# Altium schematic sheet HVP_InputDivisor_v1.0.SchDoc
size A3; Organization: SEW EURODRIVE; Address1: Jose Rubim Rd.; Address2: Santos Dumont Rd.; Address3: 205; Address4: Indaiatuba/SP; Address5: Brazil
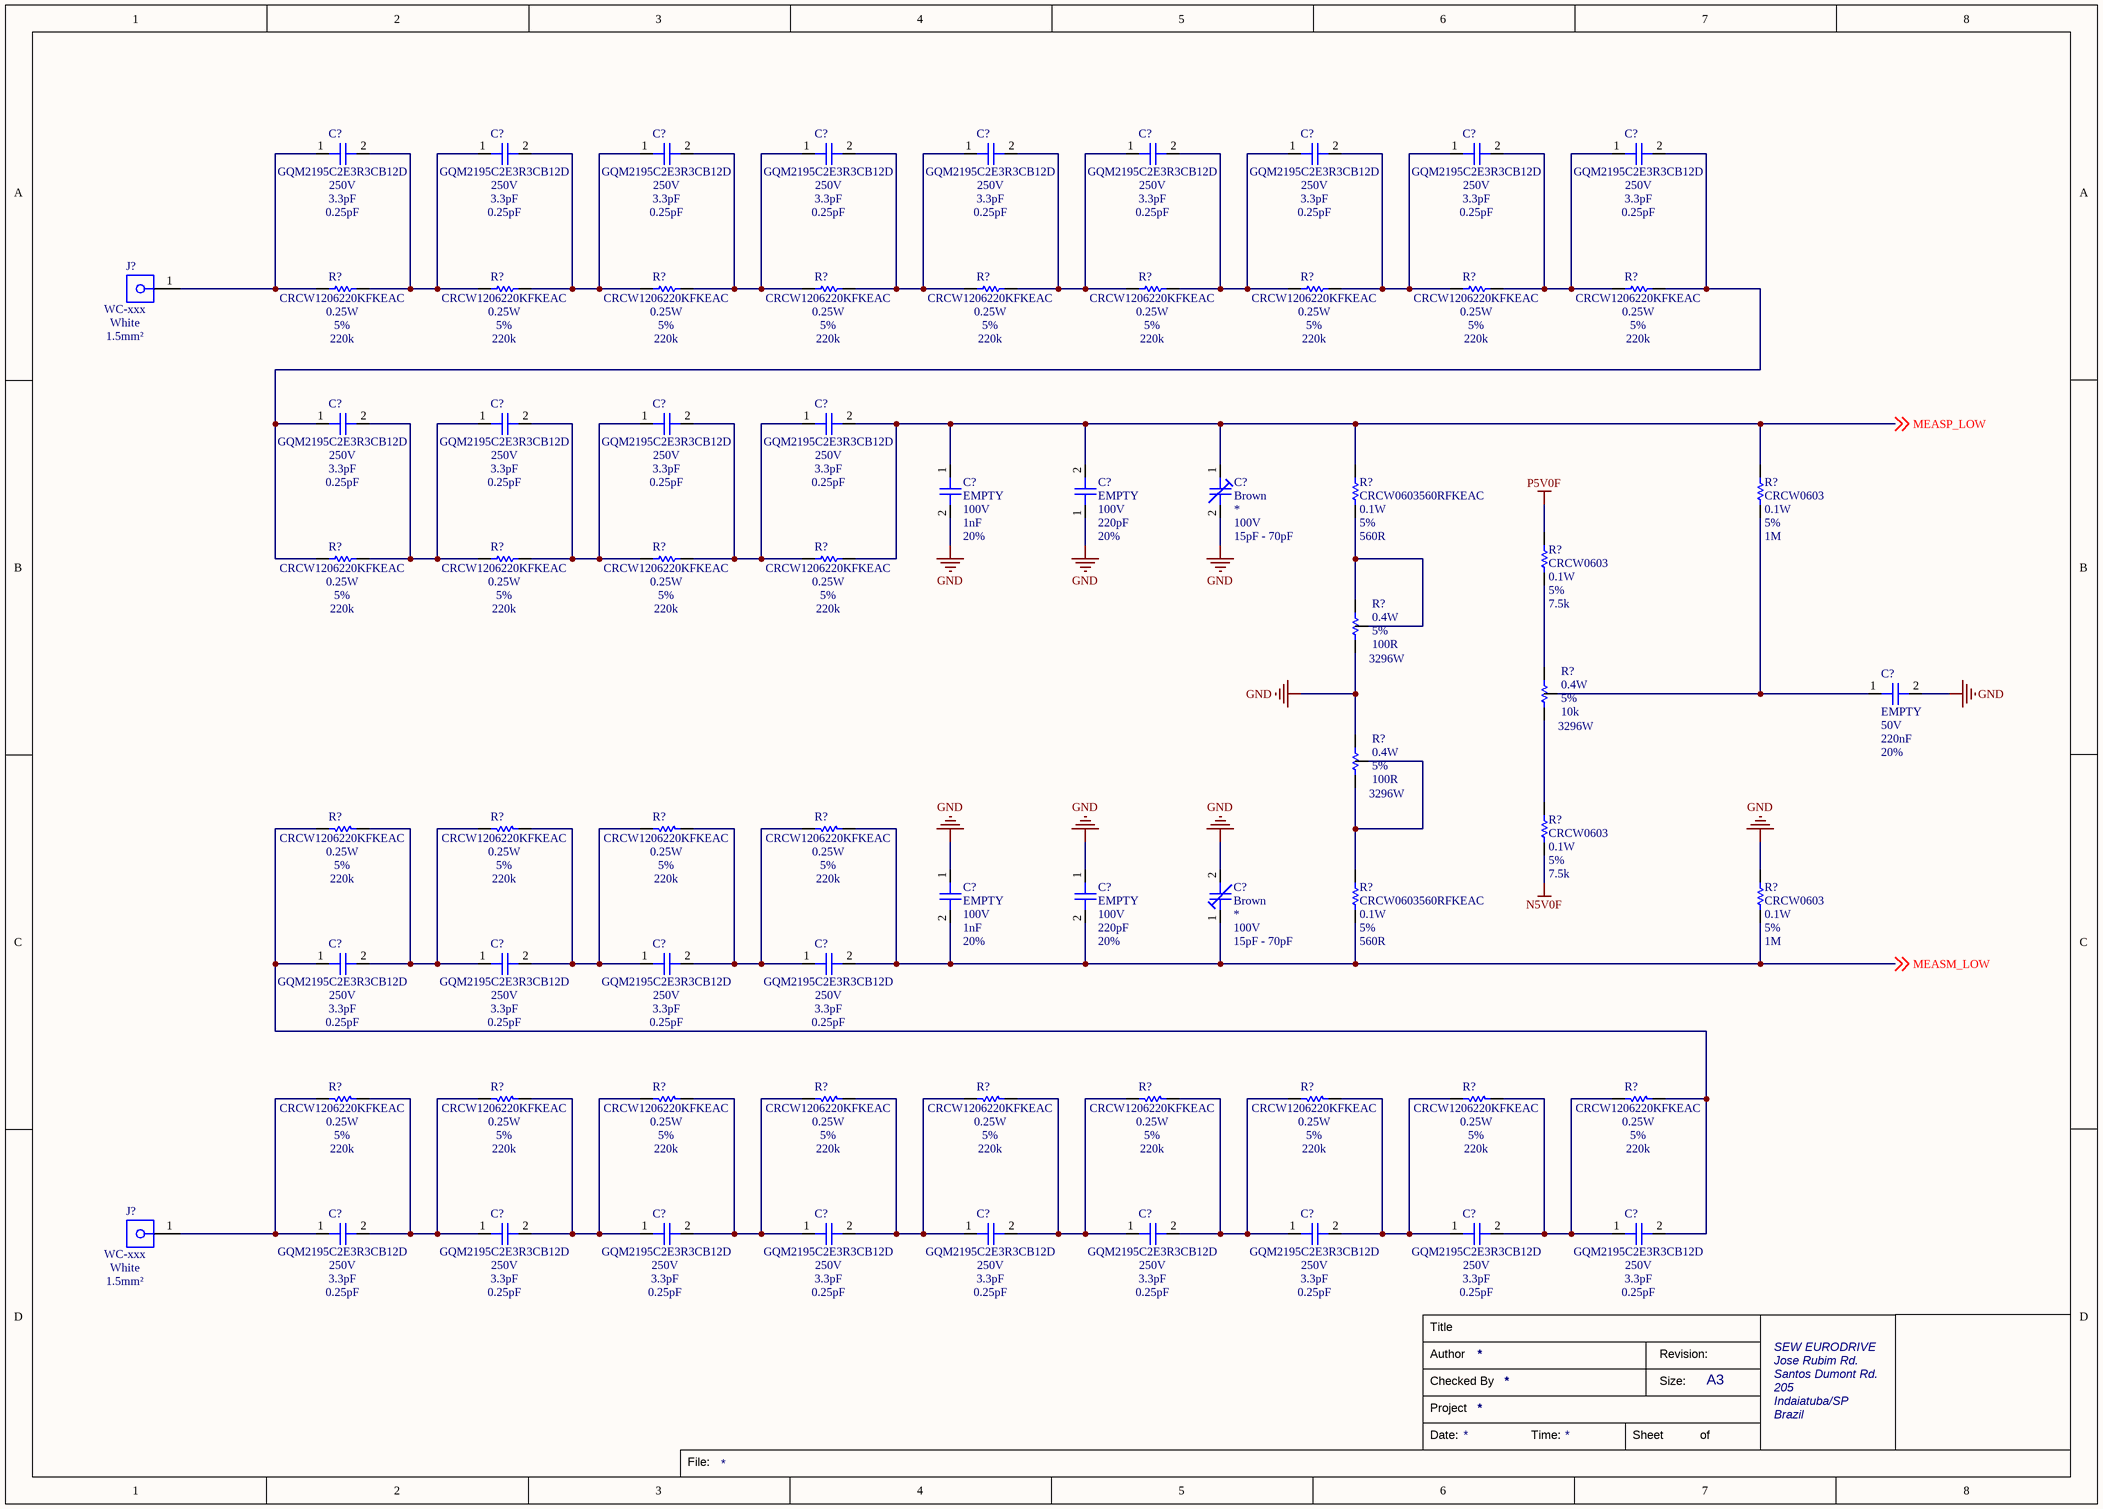
[diagram p0: HVP_InputDivisor_v1.0.SchDoc]

## Parts
(Parts that share a designator on the sheet are numbered #1, #2 ... from top to bottom, then left to right.)
C?#1  value 3.3pF  PartNumber1: GQM2195C2E3R3CB12D  Voltage: 250V  Tolerance: 0.25pF  [CAP0805]  (hidden comment: CC0805)
C?#2  value 3.3pF  PartNumber1: GQM2195C2E3R3CB12D  Voltage: 250V  Tolerance: 0.25pF  [CAP0805]  (hidden comment: CC0805)
C?#3  value 3.3pF  PartNumber1: GQM2195C2E3R3CB12D  Voltage: 250V  Tolerance: 0.25pF  [CAP0805]  (hidden comment: CC0805)
C?#4  value 3.3pF  PartNumber1: GQM2195C2E3R3CB12D  Voltage: 250V  Tolerance: 0.25pF  [CAP0805]  (hidden comment: CC0805)
C?#5  value 3.3pF  PartNumber1: GQM2195C2E3R3CB12D  Voltage: 250V  Tolerance: 0.25pF  [CAP0805]  (hidden comment: CC0805)
C?#6  value 3.3pF  PartNumber1: GQM2195C2E3R3CB12D  Voltage: 250V  Tolerance: 0.25pF  [CAP0805]  (hidden comment: CC0805)
C?#7  value 3.3pF  PartNumber1: GQM2195C2E3R3CB12D  Voltage: 250V  Tolerance: 0.25pF  [CAP0805]  (hidden comment: CC0805)
C?#8  value 3.3pF  PartNumber1: GQM2195C2E3R3CB12D  Voltage: 250V  Tolerance: 0.25pF  [CAP0805]  (hidden comment: CC0805)
C?#9  value 3.3pF  PartNumber1: GQM2195C2E3R3CB12D  Voltage: 250V  Tolerance: 0.25pF  [CAP0805]  (hidden comment: CC0805)
C?#10  value 3.3pF  PartNumber1: GQM2195C2E3R3CB12D  Voltage: 250V  Tolerance: 0.25pF  [CAP0805]  (hidden comment: CC0805)
C?#11  value 3.3pF  PartNumber1: GQM2195C2E3R3CB12D  Voltage: 250V  Tolerance: 0.25pF  [CAP0805]  (hidden comment: CC0805)
C?#12  value 3.3pF  PartNumber1: GQM2195C2E3R3CB12D  Voltage: 250V  Tolerance: 0.25pF  [CAP0805]  (hidden comment: CC0805)
C?#13  value 3.3pF  PartNumber1: GQM2195C2E3R3CB12D  Voltage: 250V  Tolerance: 0.25pF  [CAP0805]  (hidden comment: CC0805)
C?#14  value 1nF  PartNumber1: EMPTY  Voltage: 100V  Tolerance: 20%  [CAP0603]  (hidden comment: CC0603)
C?#15  value 220pF  PartNumber1: EMPTY  Voltage: 100V  Tolerance: 20%  [CAP0603]  (hidden comment: CC0603)
C?#16  value 15pF - 70pF  Colour: Brown  Voltage: 100V  [TrimmerBrown]  (hidden comment: TrimmerBrown_70pF_100V)
C?#17  value 220nF  PartNumber1: EMPTY  Voltage: 50V  Tolerance: 20%  [CAP0603]  (hidden comment: CC0603)
C?#18  value 1nF  PartNumber1: EMPTY  Voltage: 100V  Tolerance: 20%  [CAP0603]  (hidden comment: CC0603)
C?#19  value 220pF  PartNumber1: EMPTY  Voltage: 100V  Tolerance: 20%  [CAP0603]  (hidden comment: CC0603)
C?#20  value 15pF - 70pF  Colour: Brown  Voltage: 100V  [TrimmerBrown]  (hidden comment: TrimmerBrown_70pF_100V)
C?#21  value 3.3pF  PartNumber1: GQM2195C2E3R3CB12D  Voltage: 250V  Tolerance: 0.25pF  [CAP0805]  (hidden comment: CC0805)
C?#22  value 3.3pF  PartNumber1: GQM2195C2E3R3CB12D  Voltage: 250V  Tolerance: 0.25pF  [CAP0805]  (hidden comment: CC0805)
C?#23  value 3.3pF  PartNumber1: GQM2195C2E3R3CB12D  Voltage: 250V  Tolerance: 0.25pF  [CAP0805]  (hidden comment: CC0805)
C?#24  value 3.3pF  PartNumber1: GQM2195C2E3R3CB12D  Voltage: 250V  Tolerance: 0.25pF  [CAP0805]  (hidden comment: CC0805)
C?#25  value 3.3pF  PartNumber1: GQM2195C2E3R3CB12D  Voltage: 250V  Tolerance: 0.25pF  [CAP0805]  (hidden comment: CC0805)
C?#26  value 3.3pF  PartNumber1: GQM2195C2E3R3CB12D  Voltage: 250V  Tolerance: 0.25pF  [CAP0805]  (hidden comment: CC0805)
C?#27  value 3.3pF  PartNumber1: GQM2195C2E3R3CB12D  Voltage: 250V  Tolerance: 0.25pF  [CAP0805]  (hidden comment: CC0805)
C?#28  value 3.3pF  PartNumber1: GQM2195C2E3R3CB12D  Voltage: 250V  Tolerance: 0.25pF  [CAP0805]  (hidden comment: CC0805)
C?#29  value 3.3pF  PartNumber1: GQM2195C2E3R3CB12D  Voltage: 250V  Tolerance: 0.25pF  [CAP0805]  (hidden comment: CC0805)
C?#30  value 3.3pF  PartNumber1: GQM2195C2E3R3CB12D  Voltage: 250V  Tolerance: 0.25pF  [CAP0805]  (hidden comment: CC0805)
C?#31  value 3.3pF  PartNumber1: GQM2195C2E3R3CB12D  Voltage: 250V  Tolerance: 0.25pF  [CAP0805]  (hidden comment: CC0805)
C?#32  value 3.3pF  PartNumber1: GQM2195C2E3R3CB12D  Voltage: 250V  Tolerance: 0.25pF  [CAP0805]  (hidden comment: CC0805)
C?#33  value 3.3pF  PartNumber1: GQM2195C2E3R3CB12D  Voltage: 250V  Tolerance: 0.25pF  [CAP0805]  (hidden comment: CC0805)
J?#1  WireCode: WC-xxx  WireColour: White  WireSize: 1.5mm²  [WireConnector1.5mm2]  (hidden comment: Wire Connector 1.5mm2)
J?#2  WireCode: WC-xxx  WireColour: White  WireSize: 1.5mm²  [WireConnector1.5mm2]  (hidden comment: Wire Connector 1.5mm2)
R?#1  value 220k  PartNumber1: CRCW1206220KFKEAC  Power: 0.25W  Tolerance: 5%  [RES1206]  (hidden comment: Chip Resistor)
R?#2  value 220k  PartNumber1: CRCW1206220KFKEAC  Power: 0.25W  Tolerance: 5%  [RES1206]  (hidden comment: Chip Resistor)
R?#3  value 220k  PartNumber1: CRCW1206220KFKEAC  Power: 0.25W  Tolerance: 5%  [RES1206]  (hidden comment: Chip Resistor)
R?#4  value 220k  PartNumber1: CRCW1206220KFKEAC  Power: 0.25W  Tolerance: 5%  [RES1206]  (hidden comment: Chip Resistor)
R?#5  value 220k  PartNumber1: CRCW1206220KFKEAC  Power: 0.25W  Tolerance: 5%  [RES1206]  (hidden comment: Chip Resistor)
R?#6  value 220k  PartNumber1: CRCW1206220KFKEAC  Power: 0.25W  Tolerance: 5%  [RES1206]  (hidden comment: Chip Resistor)
R?#7  value 220k  PartNumber1: CRCW1206220KFKEAC  Power: 0.25W  Tolerance: 5%  [RES1206]  (hidden comment: Chip Resistor)
R?#8  value 220k  PartNumber1: CRCW1206220KFKEAC  Power: 0.25W  Tolerance: 5%  [RES1206]  (hidden comment: Chip Resistor)
R?#9  value 220k  PartNumber1: CRCW1206220KFKEAC  Power: 0.25W  Tolerance: 5%  [RES1206]  (hidden comment: Chip Resistor)
R?#10  value 560R  PartNumber1: CRCW0603560RFKEAC  Power: 0.1W  Tolerance: 5%  [RES0603]  (hidden comment: Chip Resistor)
R?#11  value 1M  Power: 0.1W  Tolerance: 5%  [RES0603]  (hidden comment: Chip Resistor)
R?#12  value 220k  PartNumber1: CRCW1206220KFKEAC  Power: 0.25W  Tolerance: 5%  [RES1206]  (hidden comment: Chip Resistor)
R?#13  value 220k  PartNumber1: CRCW1206220KFKEAC  Power: 0.25W  Tolerance: 5%  [RES1206]  (hidden comment: Chip Resistor)
R?#14  value 220k  PartNumber1: CRCW1206220KFKEAC  Power: 0.25W  Tolerance: 5%  [RES1206]  (hidden comment: Chip Resistor)
R?#15  value 220k  PartNumber1: CRCW1206220KFKEAC  Power: 0.25W  Tolerance: 5%  [RES1206]  (hidden comment: Chip Resistor)
R?#16  value 7.5k  Power: 0.1W  Tolerance: 5%  [RES0603]  (hidden comment: Chip Resistor)
R?#17  value 100R  Power: 0.4W  Tolerance: 5%  [3296W]  (hidden comment: 3296W)
R?#18  value 10k  Power: 0.4W  Tolerance: 5%  [3296W]  (hidden comment: 3296W)
R?#19  value 100R  Power: 0.4W  Tolerance: 5%  [3296W]  (hidden comment: 3296W)
R?#20  value 220k  PartNumber1: CRCW1206220KFKEAC  Power: 0.25W  Tolerance: 5%  [RES1206]  (hidden comment: Chip Resistor)
R?#21  value 220k  PartNumber1: CRCW1206220KFKEAC  Power: 0.25W  Tolerance: 5%  [RES1206]  (hidden comment: Chip Resistor)
R?#22  value 220k  PartNumber1: CRCW1206220KFKEAC  Power: 0.25W  Tolerance: 5%  [RES1206]  (hidden comment: Chip Resistor)
R?#23  value 220k  PartNumber1: CRCW1206220KFKEAC  Power: 0.25W  Tolerance: 5%  [RES1206]  (hidden comment: Chip Resistor)
R?#24  value 7.5k  Power: 0.1W  Tolerance: 5%  [RES0603]  (hidden comment: Chip Resistor)
R?#25  value 560R  PartNumber1: CRCW0603560RFKEAC  Power: 0.1W  Tolerance: 5%  [RES0603]  (hidden comment: Chip Resistor)
R?#26  value 1M  Power: 0.1W  Tolerance: 5%  [RES0603]  (hidden comment: Chip Resistor)
R?#27  value 220k  PartNumber1: CRCW1206220KFKEAC  Power: 0.25W  Tolerance: 5%  [RES1206]  (hidden comment: Chip Resistor)
R?#28  value 220k  PartNumber1: CRCW1206220KFKEAC  Power: 0.25W  Tolerance: 5%  [RES1206]  (hidden comment: Chip Resistor)
R?#29  value 220k  PartNumber1: CRCW1206220KFKEAC  Power: 0.25W  Tolerance: 5%  [RES1206]  (hidden comment: Chip Resistor)
R?#30  value 220k  PartNumber1: CRCW1206220KFKEAC  Power: 0.25W  Tolerance: 5%  [RES1206]  (hidden comment: Chip Resistor)
R?#31  value 220k  PartNumber1: CRCW1206220KFKEAC  Power: 0.25W  Tolerance: 5%  [RES1206]  (hidden comment: Chip Resistor)
R?#32  value 220k  PartNumber1: CRCW1206220KFKEAC  Power: 0.25W  Tolerance: 5%  [RES1206]  (hidden comment: Chip Resistor)
R?#33  value 220k  PartNumber1: CRCW1206220KFKEAC  Power: 0.25W  Tolerance: 5%  [RES1206]  (hidden comment: Chip Resistor)
R?#34  value 220k  PartNumber1: CRCW1206220KFKEAC  Power: 0.25W  Tolerance: 5%  [RES1206]  (hidden comment: Chip Resistor)
R?#35  value 220k  PartNumber1: CRCW1206220KFKEAC  Power: 0.25W  Tolerance: 5%  [RES1206]  (hidden comment: Chip Resistor)

## Nets
GND: C?#14.2 C?#15.1 C?#16.2 C?#17.2 C?#18.1 C?#19.1 C?#20.2 R?#17.3 R?#19.1 R?#26.2
N5V0F: R?#24.1
P5V0F: R?#16.2
MEASM_LOW: C?#18.2 C?#19.2 C?#20.1 C?#24.2 R?#23.2 R?#25.1 R?#26.1 ; off-sheet MEASM_LOW
MEASP_LOW: C?#13.2 C?#14.1 C?#15.2 C?#16.1 R?#10.2 R?#11.1 R?#15.2 ; off-sheet MEASP_LOW
NetC?#1_1: C?#1.1 J?#1.1 R?#1.1
NetC?#1_2: C?#1.2 C?#2.1 R?#1.2 R?#2.1
NetC?#2_2: C?#2.2 C?#3.1 R?#2.2 R?#3.1
NetC?#3_2: C?#3.2 C?#4.1 R?#3.2 R?#4.1
NetC?#4_2: C?#4.2 C?#5.1 R?#4.2 R?#5.1
NetC?#5_2: C?#5.2 C?#6.1 R?#5.2 R?#6.1
NetC?#6_2: C?#6.2 C?#7.1 R?#6.2 R?#7.1
NetC?#7_2: C?#7.2 C?#8.1 R?#7.2 R?#8.1
NetC?#8_2: C?#8.2 C?#9.1 R?#8.2 R?#9.1
NetC?#9_2: C?#9.2 C?#10.1 R?#9.2 R?#12.1
NetC?#10_2: C?#10.2 C?#11.1 R?#12.2 R?#13.1
NetC?#11_2: C?#11.2 C?#12.1 R?#13.2 R?#14.1
NetC?#12_2: C?#12.2 C?#13.1 R?#14.2 R?#15.1
NetC?#17_1: C?#17.1 R?#11.2 R?#18.2
NetC?#21_1: C?#21.1 C?#33.2 R?#20.1 R?#35.2
NetC?#21_2: C?#21.2 C?#22.1 R?#20.2 R?#21.1
NetC?#22_2: C?#22.2 C?#23.1 R?#21.2 R?#22.1
NetC?#23_2: C?#23.2 C?#24.1 R?#22.2 R?#23.1
NetC?#25_1: C?#25.1 J?#2.1 R?#27.1
NetC?#25_2: C?#25.2 C?#26.1 R?#27.2 R?#28.1
NetC?#26_2: C?#26.2 C?#27.1 R?#28.2 R?#29.1
NetC?#27_2: C?#27.2 C?#28.1 R?#29.2 R?#30.1
NetC?#28_2: C?#28.2 C?#29.1 R?#30.2 R?#31.1
NetC?#29_2: C?#29.2 C?#30.1 R?#31.2 R?#32.1
NetC?#30_2: C?#30.2 C?#31.1 R?#32.2 R?#33.1
NetC?#31_2: C?#31.2 C?#32.1 R?#33.2 R?#34.1
NetC?#32_2: C?#32.2 C?#33.1 R?#34.2 R?#35.1
NetR?#10_1: R?#10.1 R?#17.1 R?#17.2
NetR?#16_1: R?#16.1 R?#18.1
NetR?#18_3: R?#18.3 R?#24.2
NetR?#19_2: R?#19.2 R?#19.3 R?#25.2

## Notes on the sheet
- Title
- Author
- Checked By
- Size:
- Revision:
- A3
- Date:
- Project
- Time:
- Sheet
- of
- File:

## Library data of the parts
C?#1-C?#13 C?#21-C?#33 = CC0805: Surface Mount Multilayer Ceramic Chip Capacitors  for Commercial Applications; Manufacter1: Yageo; Published: 19-Jun-2016; LatestRevisionDate: 19-Jun-2016; Publisher: Lucas Moraes; PackageReference: CAP0805; PackageDescription: CAP0805;2 Leads
C?#14 C?#15 C?#17-C?#19 = CC0603: Surface Mount Multilayer Ceramic Chip Capacitors  for Commercial Applications; Manufacter1: Yageo; Published: 19-Jun-2016; LatestRevisionDate: 19-Jun-2016; Publisher: Lucas Moraes; PackageReference: CAP0603; PackageDescription: CAP0603;2 Leads
C?#16 C?#20 = TrimmerBrown_70pF_100V: Trimmer / Variable Capacitors PP; Manufacter1: Tayda Electronics; Published: 10-May-2016; LatestRevisionDate: 10-May-2016; Publisher: Lucas Moraes; PackageReference: TrimmerBrown; PackageDescription: TrimmerBrown;2 Leads; Datasheet: *; PartNumber1: *
J?#1 J?#2 = Wire Connector 1.5mm2: Wire Connector 1.50mm2; Gender: Female; Published: 30-Agu-2018; LatestRevisionDate: 30-Agu-2018; PackageReference: WireConnector1.5mm2;1 pin; Publisher: Lucas Moraes; PackageDescription: WireConnecto1.5mm2; Type: Hole; Pins: 1
R?#1-R?#9 R?#12-R?#15 R?#20-R?#23 R?#27-R?#35 = CRCW1206: Thick Film Chip Resistors with CECC Approval,  available with Established Reliability; Manufacter1: Vishay / Dale; LatestRevisionDate: 06-May-2016; PackageReference: 1206; Publisher: Lucas Moraes; PackageDescription: SMD 1206; 2 Leads; Published: 06-May-2016
R?#10 R?#11 R?#16 R?#24-R?#26 = CRCW0603: Thick Film Chip Resistors with CECC Approval,  available with Established Reliability; Manufacter1: Vishay; LatestRevisionDate: 06-May-2016; PackageReference: 0603; Publisher: Lucas Moraes; PackageDescription: SMD 0603; 2 Leads; Published: 06-May-2016
  R?#11 R?#16 R?#24 R?#26: PartNumber1: CRCW0603
R?#17-R?#19 = 3296W: Trimmer Resistors - Through Hole 3/8" 100Kohms Sealed Vertical Adjust; Manufacter1: Bourns; Published: 22-May-2017; LatestRevisionDate: 22-May-2017; PackageReference: 3296W; Publisher: Lucas Moraes; PackageDescription: 3386F; 3 Leads; PartNumber1: 3296W